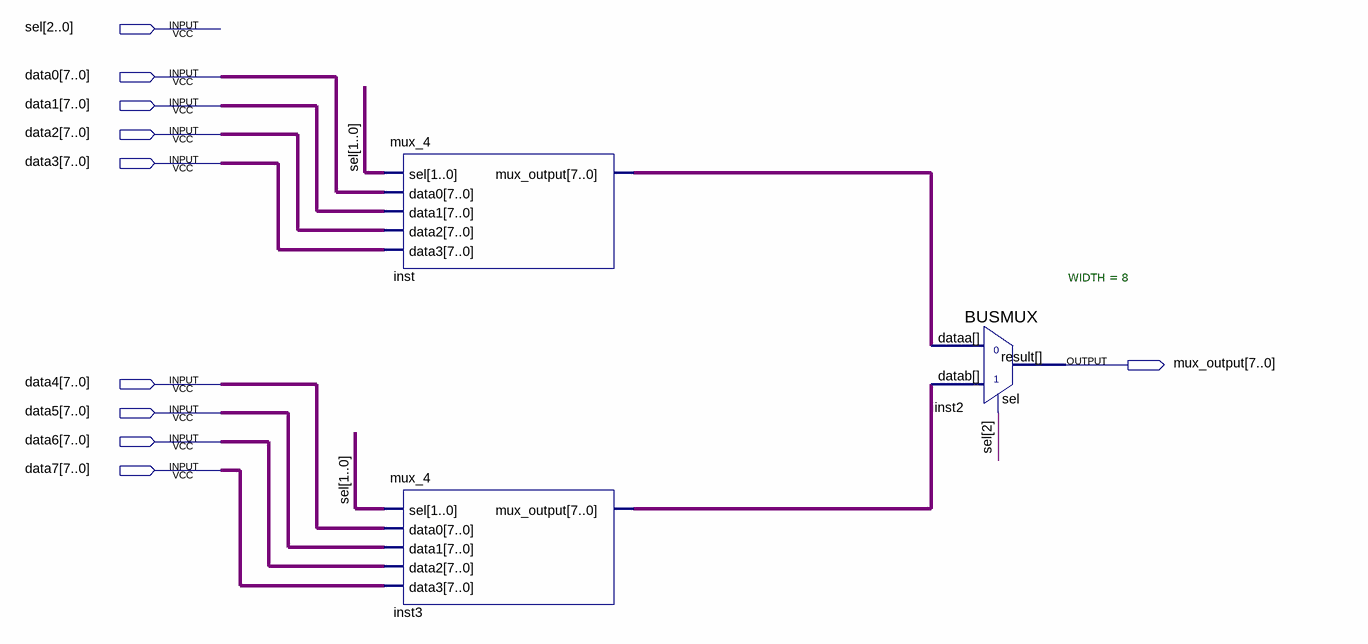
[diagram p0: schematic sheet]
// Quartus schematic mux_8.bdf as structural Verilog: 3 symbols, 10 pins
module mux_8 (
  input  [2:0] sel,
  input  [7:0] data0,
  input  [7:0] data1,
  input  [7:0] data2,
  input  [7:0] data3,
  input  [7:0] data4,
  input  [7:0] data5,
  input  [7:0] data6,
  input  [7:0] data7,
  output [7:0] mux_output
);

  wire [7:0] inst3_mux_output, inst_mux_output;

  mux_4 inst (.sel(sel[1:0]), .data0(data0), .data1(data1), .data2(data2), .data3(data3), .mux_output(inst_mux_output));
  mux_4 inst3 (
    .sel(sel[1:0]), .data0(data4), .data1(data5), .data2(data6), .data3(data7), .mux_output(inst3_mux_output));
  BUSMUX #(.WIDTH(8)) inst2 (.datab(inst3_mux_output), .sel(sel[2]), .dataa(inst_mux_output), .result(mux_output));
endmodule
